# Altium schematic sheet PMIC_EA3036.SchDoc
size A3; SheetNumber: 9; SheetTotal: 9
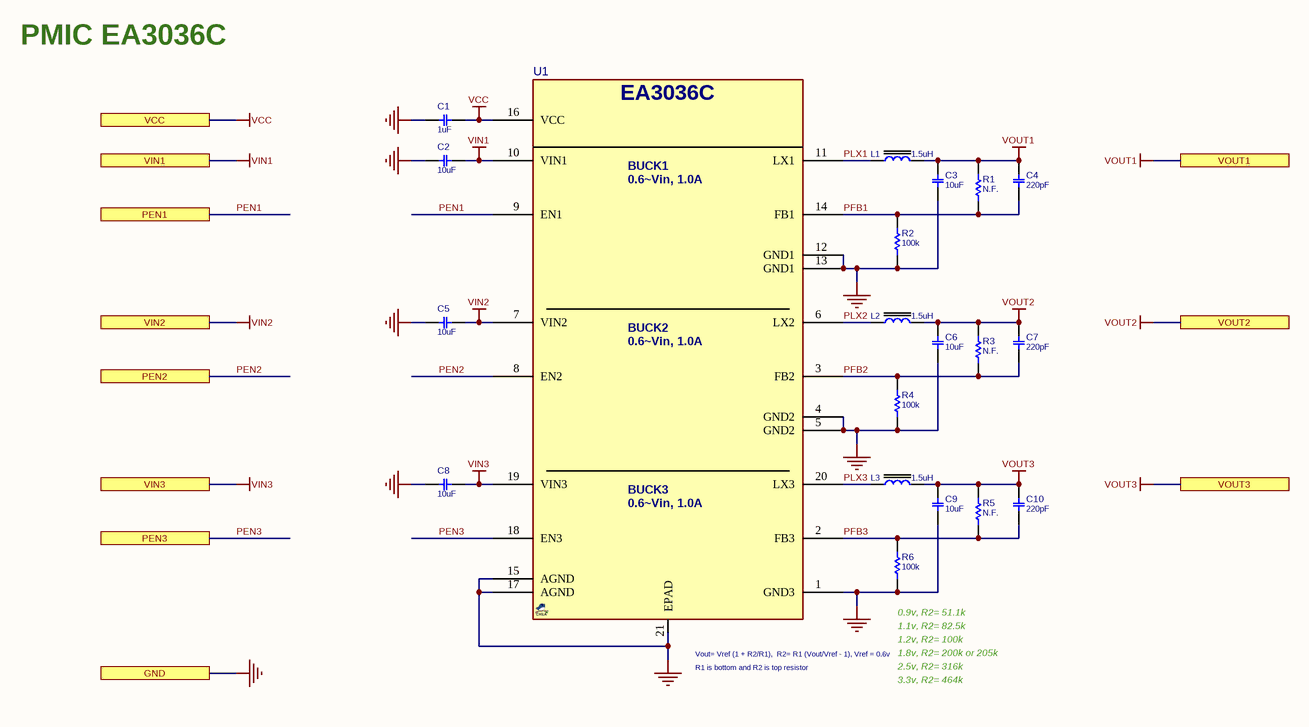
[diagram p0: PMIC_EA3036.SchDoc]

## Parts
C1  1uF  [C0402]
C2  10uF  [C0402]
C3  10uF  [C0402]
C4  220pF  [C0402]
C5  10uF  [C0402]
C6  10uF  [C0402]
C7  220pF  [C0402]
C8  10uF  [C0402]
C9  10uF  [C0402]
C10  220pF  [C0402]
L1  1.5uH  [L_3]
L2  1.5uH  [L_3]
L3  1.5uH  [L_3]
R1  N.F.  [R0402]
R2  100k  [R0402]
R3  N.F.  [R0402]
R4  100k  [R0402]
R5  N.F.  [R0402]
R6  100k  [R0402]
U1  EA3036C  [QFN40_20T]  (value not drawn)

## Ports
GND, PEN1, PEN2, PEN3, VCC, VIN1, VIN2, VIN3, VOUT1, VOUT2, VOUT3

## Nets
GND: C1.1 C2.1 C3.1 C5.1 C6.1 C8.1 C9.1 R2.2 R4.2 R6.2 U1.1(GND3) U1.4(GND2) U1.5(GND2) U1.12(GND1) U1.13(GND1) U1.15(AGND) U1.17(AGND) U1.21(EPAD) ; port GND
VCC: C1.2 U1.16(VCC) ; port VCC
VIN1: C2.2 U1.10(VIN1) ; port VIN1
VIN2: C5.2 U1.7(VIN2) ; port VIN2
VIN3: C8.2 U1.19(VIN3) ; port VIN3
VOUT1: C3.2 C4.2 L1.2 R1.1 ; port VOUT1
VOUT2: C6.2 C7.2 L2.2 R3.1 ; port VOUT2
VOUT3: C9.2 C10.2 L3.2 R5.1 ; port VOUT3
PEN1: U1.9(EN1) ; port PEN1
PEN2: U1.8(EN2) ; port PEN2
PEN3: U1.18(EN3) ; port PEN3
PFB1: C4.1 R1.2 R2.1 U1.14(FB1)
PFB2: C7.1 R3.2 R4.1 U1.3(FB2)
PFB3: C10.1 R5.2 R6.1 U1.2(FB3)
PLX1: L1.1 U1.11(LX1)
PLX2: L2.1 U1.6(LX2)
PLX3: L3.1 U1.20(LX3)

## Notes on the sheet
- PMIC EA3036C
- (near R6) 0.9v, R2= 51.1k
- (near U1) Vout= Vref (1 + R2/R1),  R2= R1 (Vout/Vref - 1), Vref = 0.6v
- (near U1) R1 is bottom and R2 is top resistor
- (near R6) 1.1v, R2= 82.5k
- 1.2v, R2= 100k
- 1.8v, R2= 200k or 205k
- 2.5v, R2= 316k
- 3.3v, R2= 464k
- (in symbol EA3036C_QFN20) BUCK1; 0.6~Vin, 1.0A; BUCK2; BUCK3

## Library data of the parts
C1 = CAP_SMD_MLCC: CAP, MLCC; PARAM: X5R, 10%; MANF_P#: GMK105ABJ105KV-F; MANF: Taiyo Yuden; PARAM2: 35v; PRICE: 100: 0.06$; ASSEMBLY: ASSEMBLY; VALUE: 1uF
C2 C3 C5 C6 C8 C9 = CAP_SMD_MLCC: CAP, MLCC; PARAM: X5R, 20%; MANF_P#: CL05A106MP5NUNC; MANF: Samsung; PARAM2: 10v; PRICE: 10,000: $0.034; ASSEMBLY: ASSEMBLY; VALUE: 10uF
C4 C7 C10 = CAP_SMD_MLCC: CAP, MLCC; PARAM: -; PRICE: -; MANF_P#: -; MANF: -; PARAM2: -; ASSEMBLY: ASSEMBLY; VALUE: 220pF
L1-L3 = IND_SMD_2.2uH_2.6A: INDUCTOR; PARAM: 1.7A, -40~125oC; MANF_P#: NRH3012T1R5NN; PARAM2: 20%, 60mOhm; MANF_P#2: FNR3015S1R8NT; PRICE: 0.03$; MANF: -; ASSEMBLY: ASSEMBLY; VALUE: 1.5uH
R1-R6 = RES_SMD: RESISTOR, SMD; PARAM: 0.063W; DESC: DESCRIPTION; DIST#: MOUSER; PARAM2: 1%; MANF_P#: -; MANF: -; ASSEMBLY: ASSEMBLY; PRICE: 100= 0.3$
  R1 R3 R5: VALUE: N.F.
  R2 R4 R6: VALUE: 100k
U1 = EA3036C_QFN20: IC, Regulator PMIC, 3DCDC 1.5MHz, total must be under 6W; MANF: Everanalog; MANF_P#: EA3036CQBR; PARAM2: 2.7~5.5Vin, 3 DCDC 1.5MHz; PARAM: -40~85°C; PRICE: 0.2$; VALUE: EA3036C; PACKAGE: QFN-20, 0.4mm pitch